# EAGLE schematic SparkFun_Thing_Plus_RA6M5 (EAGLE 9.6.2)

## Sheet 1 of 2
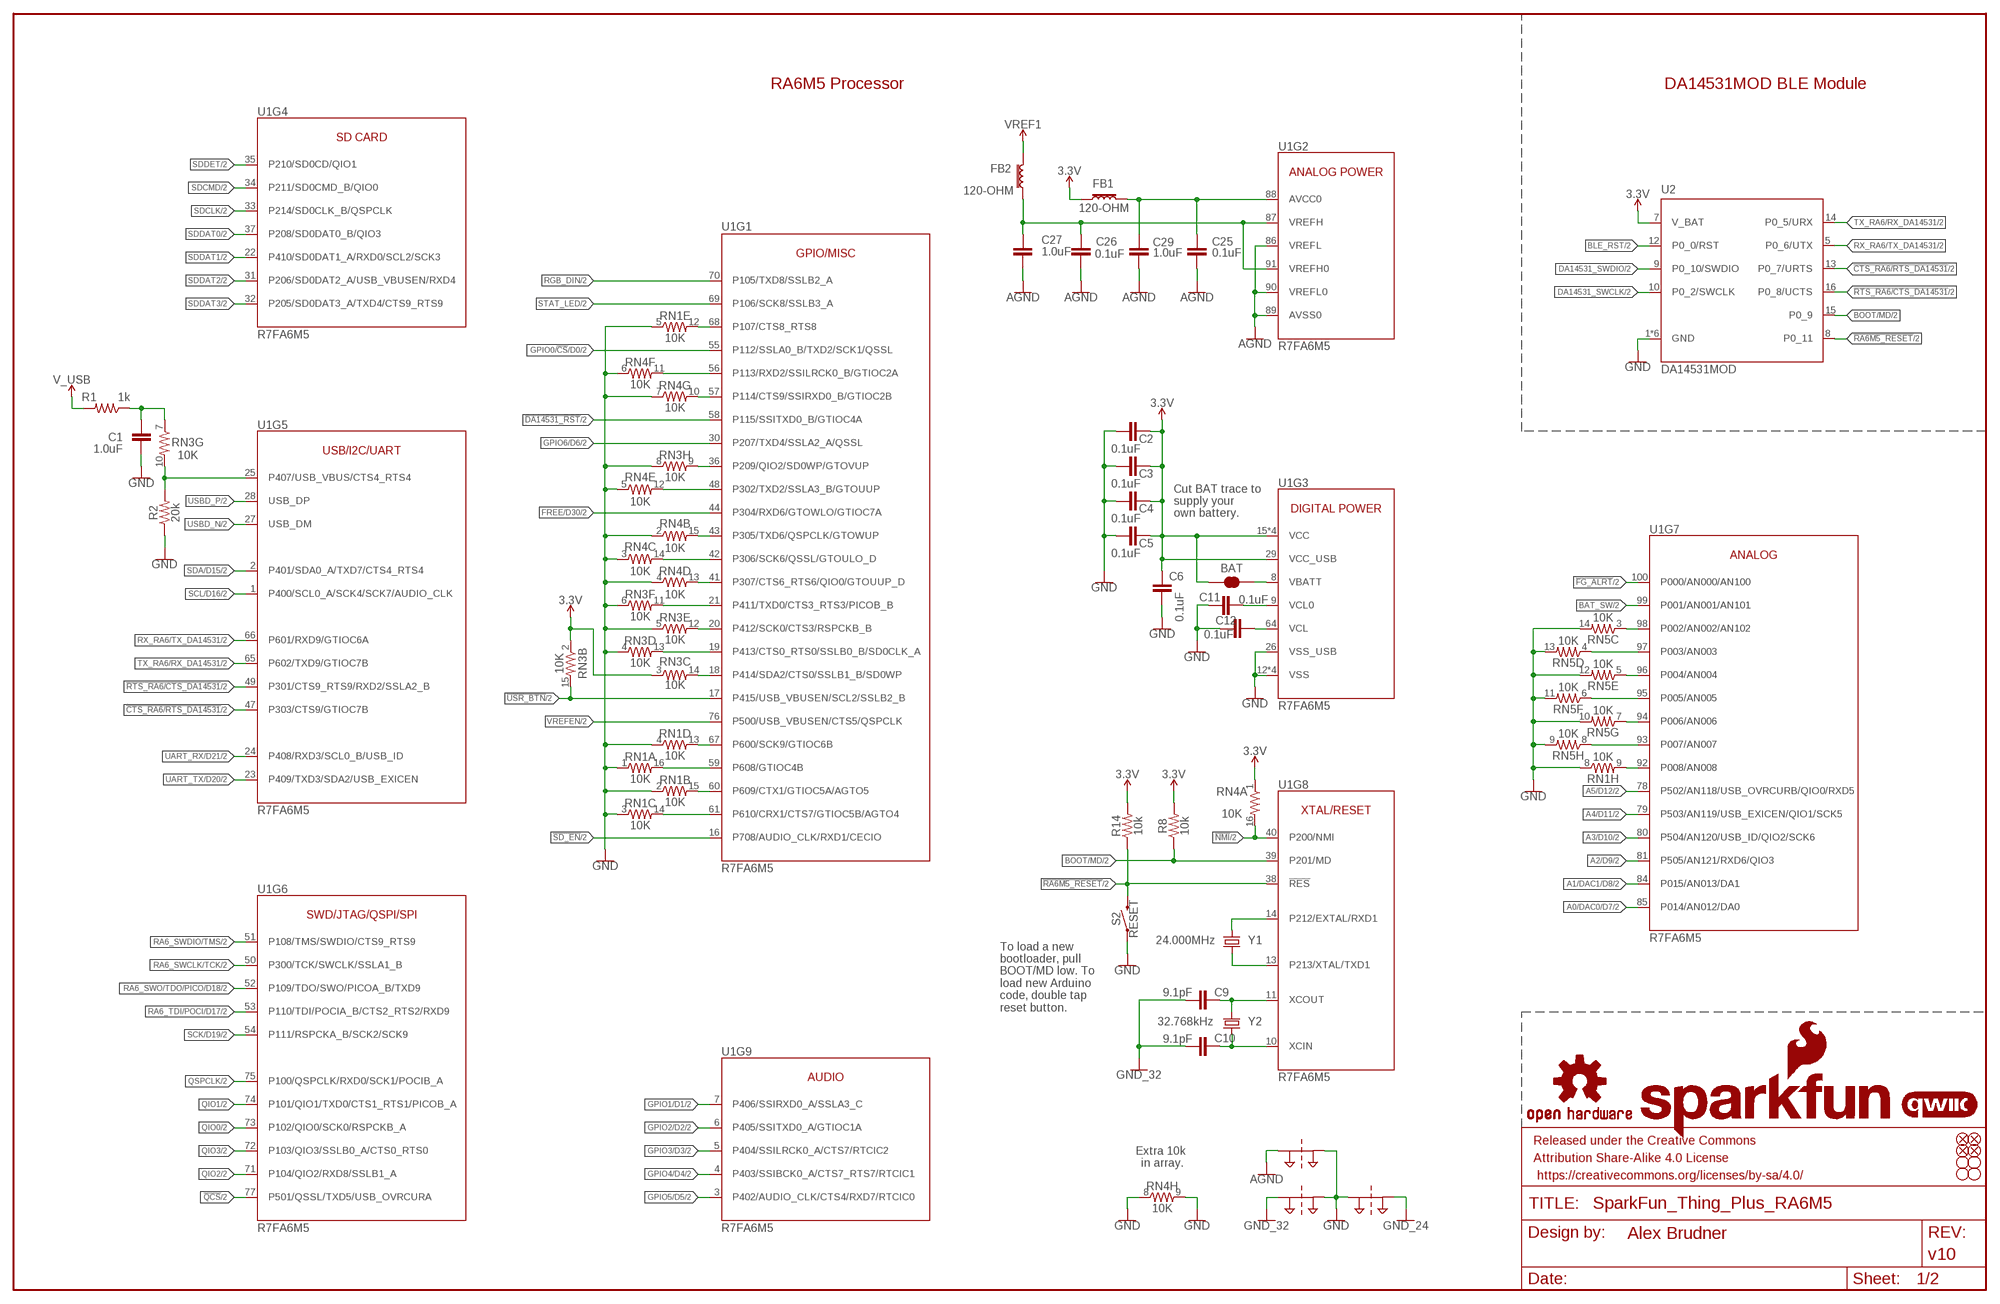
[diagram p0: schematic, sheet 1]

### Parts
BAT  JUMPER-SMT_2_NC_TRACE_SILK  [SMT-JUMPER_2_NC_TRACE_SILK]
C1  1.0uF  1.0UF-0402T-16V-10%  [0402-TIGHT]
C2  0.1uF  0.1UF-0402T-16V-10%  [0402-TIGHT]
C3  0.1uF  0.1UF-0402T-16V-10%  [0402-TIGHT]
C4  0.1uF  0.1UF-0402T-16V-10%  [0402-TIGHT]
C5  0.1uF  0.1UF-0402T-16V-10%  [0402-TIGHT]
C6  0.1uF  0.1UF-0402T-16V-10%  [0402-TIGHT]
C9  9.1pF  9.1PF-0402-TIGHT  [0402-TIGHT]
C10  9.1pF  9.1PF-0402-TIGHT  [0402-TIGHT]
C11  0.1uF  0.1UF-0402T-16V-10%  [0402-TIGHT]
C12  0.1uF  0.1UF-0402T-16V-10%  [0402-TIGHT]
C25  0.1uF  0.1UF-0402T-16V-10%  [0402-TIGHT]
C26  0.1uF  0.1UF-0402T-16V-10%  [0402-TIGHT]
C27  1.0uF  1.0UF-0402T-16V-10%  [0402-TIGHT]
C29  1.0uF  1.0UF-0402T-16V-10%  [0402-TIGHT]
FB1  120-OHM  FERRITE_BEAD-120_OHM-0402T  [0402-TIGHT]
FB2  120-OHM  FERRITE_BEAD-120_OHM-0402T  [0402-TIGHT]
FD1  FIDUCIALUFIDUCIAL  [FIDUCIAL-MICRO]
FD2  FIDUCIALUFIDUCIAL  [FIDUCIAL-MICRO]
FD3  FIDUCIALUFIDUCIAL  [FIDUCIAL-MICRO]
FD4  FIDUCIALUFIDUCIAL  [FIDUCIAL-MICRO]
FRAME1  FRAME-LEDGER  [CREATIVE_COMMONS]
H1  STAND-OFFTIGHT  [STAND-OFF-TIGHT]
H2  STAND-OFFTIGHT  [STAND-OFF-TIGHT]
H3  STAND-OFFTIGHT  [STAND-OFF-TIGHT]
H4  STAND-OFFTIGHT  [STAND-OFF-TIGHT]
LOGO1  OSHW-LOGOMINI  [OSHW-LOGO-MINI]
LOGO2  SFE_LOGO_NAME_FLAME.1_INCH  [SFE_LOGO_NAME_FLAME_.1]
LOGO3  QWIIC_LOGO_4MM  [QWIIC_4MM]
R1  1k  1KOHM-0402T-1/16W-1%  [0402-TIGHT]
R2  20k  20KOHM-0402T-1/16W-1%  [0402-TIGHT]
R8  10k  10KOHM-0402T-1/16W-1%  [0402-TIGHT]
R14  10k  10KOHM-0402T-1/16W-1%  [0402-TIGHT]
RN1  10K  10KOHM-ARRAY(8)-2506_ARV-1/16W-5%  [2506_AR]
RN3  10K  10KOHM-ARRAY(8)-2506_ARV-1/16W-5%  [2506_AR]
RN4  10K  10KOHM-ARRAY(8)-2506_ARV-1/16W-5%  [2506_AR]
RN5  10K  10KOHM-ARRAY(8)-2506_ARV-1/16W-5%  [2506_AR]
S2  RESET  MOMENTARY-SWITCH-SPST-SMD-4.6X2.8MM  [TACTILE_SWITCH_SMD_4.6X2.8MM]
SUPPLYTIE1  2PT_GND_TIESMALL  [2PT_GND_TIE_SMALL]
SUPPLYTIE2  2PT_GND_TIESMALL  [2PT_GND_TIE_SMALL]
SUPPLYTIE3  2PT_GND_TIESMALL  [2PT_GND_TIE_SMALL]
U1  R7FA6M5  R7FA6M5-100LQFP  [P-LQFP100-14X14-0.50]
U2  DA14531MOD  [DA14531MOD]
Y1  24.000MHz  CRYSTAL-24.000MHZ-8PF-4-SMD  [4-SMD,32X25]
Y2  32.768kHz  CRYSTAL-32.768KHZSMD-3.2X1.5  [CRYSTAL-SMD-3.2X1.5MM]

### Nets
3.3V [Power]: BAT.1 C2.1 C3.1 C4.1 C5.1 C6.1 FB1.1 R8.2 R14.2 RN3.2 RN3.3 RN4.1 U1.15(VCC) U1.29(VCC_USB) U1.46(VCC) U1.62(VCC) U1.82(VCC) U2.7(V_BAT) ; also sheet 2
!CTS_RA6/RTS_DA14531! [LS Digital]: U1.47(P303/CTS9/GTIOC7B) U2.13(P0_7/URTS) ; also sheet 2
!DA14531_RST!: U1.58(P115/SSITXD0_B/GTIOC4A) ; also sheet 2
!FG_ALRT!: U1.100(P000/AN000/AN100) ; also sheet 2
!NMI!: RN4.16 U1.40(P200/NMI) ; also sheet 2
!QCS!: U1.77(P501/QSSL/TXD5/USB_OVRCURA) ; also sheet 2
!RA6M5_RESET!: R14.1 S2.3 S2.4 U1.38(!RES!) U2.8(P0_11) ; also sheet 2
!RTS_RA6/CTS_DA14531! [LS Digital]: U1.49(P301/CTS9_RTS9/RXD2/SSLA2_B) U2.16(P0_8/UCTS) ; also sheet 2
!SD_EN!: U1.16(P708/AUDIO_CLK/RXD1/CECIO) ; also sheet 2
!USR_BTN!: RN3.15 U1.17(P415/USB_VBUSEN/SCL2/SSLB2_B) ; also sheet 2
A0/DAC0/D7 [Analog]: U1.85(P014/AN012/DA0) ; also sheet 2
A1/DAC1/D8 [Analog]: U1.84(P015/AN013/DA1) ; also sheet 2
A2/D9 [Analog]: U1.81(P505/AN121/RXD6/QIO3) ; also sheet 2
A3/D10 [Analog]: U1.80(P504/AN120/USB_ID/QIO2/SCK6) ; also sheet 2
A4/D11 [Analog]: U1.79(P503/AN119/USB_EXICEN/QIO1/SCK5) ; also sheet 2
A5/D12 [Analog]: U1.78(P502/AN118/USB_OVRCURB/QIO0/RXD5) ; also sheet 2
AGND [Analog Ground]: C25.2 C26.2 C27.2 C29.2 SUPPLYTIE1.P$1 U1.86(VREFL) U1.89(AVSS0) U1.90(VREFL0)
AVCC0 [Power]: C25.1 C29.1 FB1.2 U1.88(AVCC0) ; also sheet 2
BAT_SW: U1.99(P001/AN001/AN101) ; also sheet 2
BLE_RST: U2.12(P0_0/RST) ; also sheet 2
BOOT/MD: R8.1 U1.39(P201/MD) U2.15(P0_9) ; also sheet 2
DA14531_SWCLK [HS Digital]: U2.10(P0_2/SWCLK) ; also sheet 2
DA14531_SWDIO [HS Digital]: U2.9(P0_10/SWDIO) ; also sheet 2
EXTAL [CLK signals]: U1.14(P212/EXTAL/RXD1) Y1.1
FREE/D30: U1.44(P304/RXD6/GTOWLO/GTIOC7A) ; also sheet 2
GND [Power]: C1.1 C2.2 C3.2 C4.2 C5.2 C6.2 C11.2 C12.2 R2.1 RN1.1 RN1.2 RN1.3 RN1.4 RN1.5 RN1.8 RN3.4 RN3.5 RN3.6 RN3.8 RN4.2 RN4.3 RN4.4 RN4.5 RN4.6 RN4.7 RN4.8 RN4.9 RN5.9 RN5.10 RN5.11 RN5.12 RN5.13 RN5.14 S2.1 S2.2 SUPPLYTIE1.P$2 SUPPLYTIE2.P$2 SUPPLYTIE3.P$1 U1.12(VSS) U1.26(VSS_USB) U1.45(VSS) U1.63(VSS) U1.83(VSS) U2.1(GND) U2.2(GND) U2.3(GND) U2.4(GND) U2.6(GND) U2.11(GND) ; also sheet 2
GND_24 [CLK grounds]: SUPPLYTIE3.P$2
GND_32 [CLK grounds]: C9.1 C10.1 SUPPLYTIE2.P$1
GPIO0/!CS!/D0: U1.55(P112/SSLA0_B/TXD2/SCK1/QSSL) ; also sheet 2
GPIO1/D1: U1.7(P406/SSIRXD0_A/SSLA3_C) ; also sheet 2
GPIO2/D2: U1.6(P405/SSITXD0_A/GTIOC1A) ; also sheet 2
GPIO3/D3: U1.5(P404/SSILRCK0_A/CTS7/RTCIC2) ; also sheet 2
GPIO4/D4: U1.4(P403/SSIBCK0_A/CTS7_RTS7/RTCIC1) ; also sheet 2
GPIO5/D5: U1.3(P402/AUDIO_CLK/CTS4/RXD7/RTCIC0) ; also sheet 2
GPIO6/D6: U1.30(P207/TXD4/SSLA2_A/QSSL) ; also sheet 2
N$7: RN1.9 U1.92(P008/AN008)
N$8: RN3.9 U1.36(P209/QIO2/SD0WP/GTOVUP)
N$9: C1.2 R1.1 RN3.7
N$13: RN3.14 U1.18(P414/SDA2/CTS0/SSLB1_B/SD0WP)
N$15: R2.2 RN3.10 U1.25(P407/USB_VBUS/CTS4_RTS4)
N$17: RN1.14 U1.61(P610/CRX1/CTS7/GTIOC5B/AGTO4)
N$18: RN1.15 U1.60(P609/CTX1/GTIOC5A/AGTO5)
N$22: RN1.16 U1.59(P608/GTIOC4B)
N$23: RN4.15 U1.43(P305/TXD6/QSPCLK/GTOWUP)
N$24: RN1.13 U1.67(P600/SCK9/GTIOC6B)
N$26: RN3.13 U1.19(P413/CTS0_RTS0/SSLB0_B/SD0CLK_A)
N$27: RN3.12 U1.20(P412/SCK0/CTS3/RSPCKB_B)
N$28: RN3.11 U1.21(P411/TXD0/CTS3_RTS3/PICOB_B)
N$29 [Power]: C26.1 C27.1 FB2.1 U1.87(VREFH) U1.91(VREFH0)
N$30: RN4.13 U1.41(P307/CTS6_RTS6/QIO0/GTOUUP_D)
N$31: RN4.12 U1.48(P302/TXD2/SSLA3_B/GTOUUP)
N$32: RN4.14 U1.42(P306/SCK6/QSSL/GTOULO_D)
N$33 [Power]: BAT.2 U1.8(VBATT)
N$35: RN4.10 U1.57(P114/CTS9/SSIRXD0_B/GTIOC2B)
N$36: RN4.11 U1.56(P113/RXD2/SSILRCK0_B/GTIOC2A)
N$37: RN1.12 U1.68(P107/CTS8_RTS8)
N$41: RN5.8 U1.93(P007/AN007)
N$42: RN5.7 U1.94(P006/AN006)
N$43: RN5.6 U1.95(P005/AN005)
N$44: RN5.5 U1.96(P004/AN004)
N$45: RN5.4 U1.97(P003/AN003)
N$46: RN5.3 U1.98(P002/AN002/AN102)
N$97: C11.1 U1.9(VCL0)
N$98: C12.1 U1.64(VCL)
QIO0 [HS Digital]: U1.73(P102/QIO0/SCK0/RSPCKB_A) ; also sheet 2
QIO1 [HS Digital]: U1.74(P101/QIO1/TXD0/CTS1_RTS1/PICOB_A) ; also sheet 2
QIO2 [HS Digital]: U1.71(P104/QIO2/RXD8/SSLB1_A) ; also sheet 2
QIO3 [HS Digital]: U1.72(P103/QIO3/SSLB0_A/CTS0_RTS0) ; also sheet 2
QSPCLK [HS Digital]: U1.75(P100/QSPCLK/RXD0/SCK1/POCIB_A) ; also sheet 2
RA6_SWCLK/TCK [HS Digital]: U1.50(P300/TCK/SWCLK/SSLA1_B) ; also sheet 2
RA6_SWDIO/TMS [HS Digital]: U1.51(P108/TMS/SWDIO/CTS9_RTS9) ; also sheet 2
RA6_SWO/TDO/PICO/D18 [HS Digital]: U1.52(P109/TDO/SWO/PICOA_B/TXD9) ; also sheet 2
RA6_TDI/POCI/D17 [HS Digital]: U1.53(P110/TDI/POCIA_B/CTS2_RTS2/RXD9) ; also sheet 2
RGB_DIN [LS Digital]: U1.70(P105/TXD8/SSLB2_A) ; also sheet 2
RX_RA6/TX_DA14531 [LS Digital]: U1.66(P601/RXD9/GTIOC6A) U2.5(P0_6/UTX) ; also sheet 2
SCK/D19 [HS Digital]: U1.54(P111/RSPCKA_B/SCK2/SCK9) ; also sheet 2
SCL/D16 [LS Digital]: U1.1(P400/SCL0_A/SCK4/SCK7/AUDIO_CLK) ; also sheet 2
SDA/D15 [LS Digital]: U1.2(P401/SDA0_A/TXD7/CTS4_RTS4) ; also sheet 2
SDCLK [HS Digital]: U1.33(P214/SD0CLK_B/QSPCLK) ; also sheet 2
SDCMD [LS Digital]: U1.34(P211/SD0CMD_B/QIO0) ; also sheet 2
SDDAT0 [HS Digital]: U1.37(P208/SD0DAT0_B/QIO3) ; also sheet 2
SDDAT1 [HS Digital]: U1.22(P410/SD0DAT1_A/RXD0/SCL2/SCK3) ; also sheet 2
SDDAT2 [HS Digital]: U1.31(P206/SD0DAT2_A/USB_VBUSEN/RXD4) ; also sheet 2
SDDAT3 [HS Digital]: U1.32(P205/SD0DAT3_A/TXD4/CTS9_RTS9) ; also sheet 2
SDDET: U1.35(P210/SD0CD/QIO1) ; also sheet 2
STAT_LED: U1.69(P106/SCK8/SSLB3_A) ; also sheet 2
TX_RA6/RX_DA14531 [LS Digital]: U1.65(P602/TXD9/GTIOC7B) U2.14(P0_5/URX) ; also sheet 2
UART_RX/D21 [LS Digital]: U1.24(P408/RXD3/SCL0_B/USB_ID) ; also sheet 2
UART_TX/D20 [LS Digital]: U1.23(P409/TXD3/SDA2/USB_EXICEN) ; also sheet 2
USBD_N [USB diff]: U1.27(USB_DM) ; also sheet 2
USBD_P [USB diff]: U1.28(USB_DP) ; also sheet 2
V_USB [Power]: R1.2 ; also sheet 2
VREF1 [Power]: FB2.2 ; also sheet 2
VREFEN: U1.76(P500/USB_VBUSEN/CTS5/QSPCLK) ; also sheet 2
XCIN [CLK signals]: C10.2 U1.10(XCIN) Y2.P$1
XCOUT [CLK signals]: C9.2 U1.11(XCOUT) Y2.P$2
XTAL [CLK signals]: U1.13(P213/XTAL/TXD1) Y1.3

### Notes on the sheet
- RA6M5 Processor | DA14531MOD BLE Module
- Cut BAT trace to 
  supply your 
  own battery.
- To load a new 
  bootloader, pull 
  BOOT/MD low. To 
  load new Arduino 
  code, double tap 
  reset button.
- Extra 10k 
  in array.

## Sheet 2 of 2
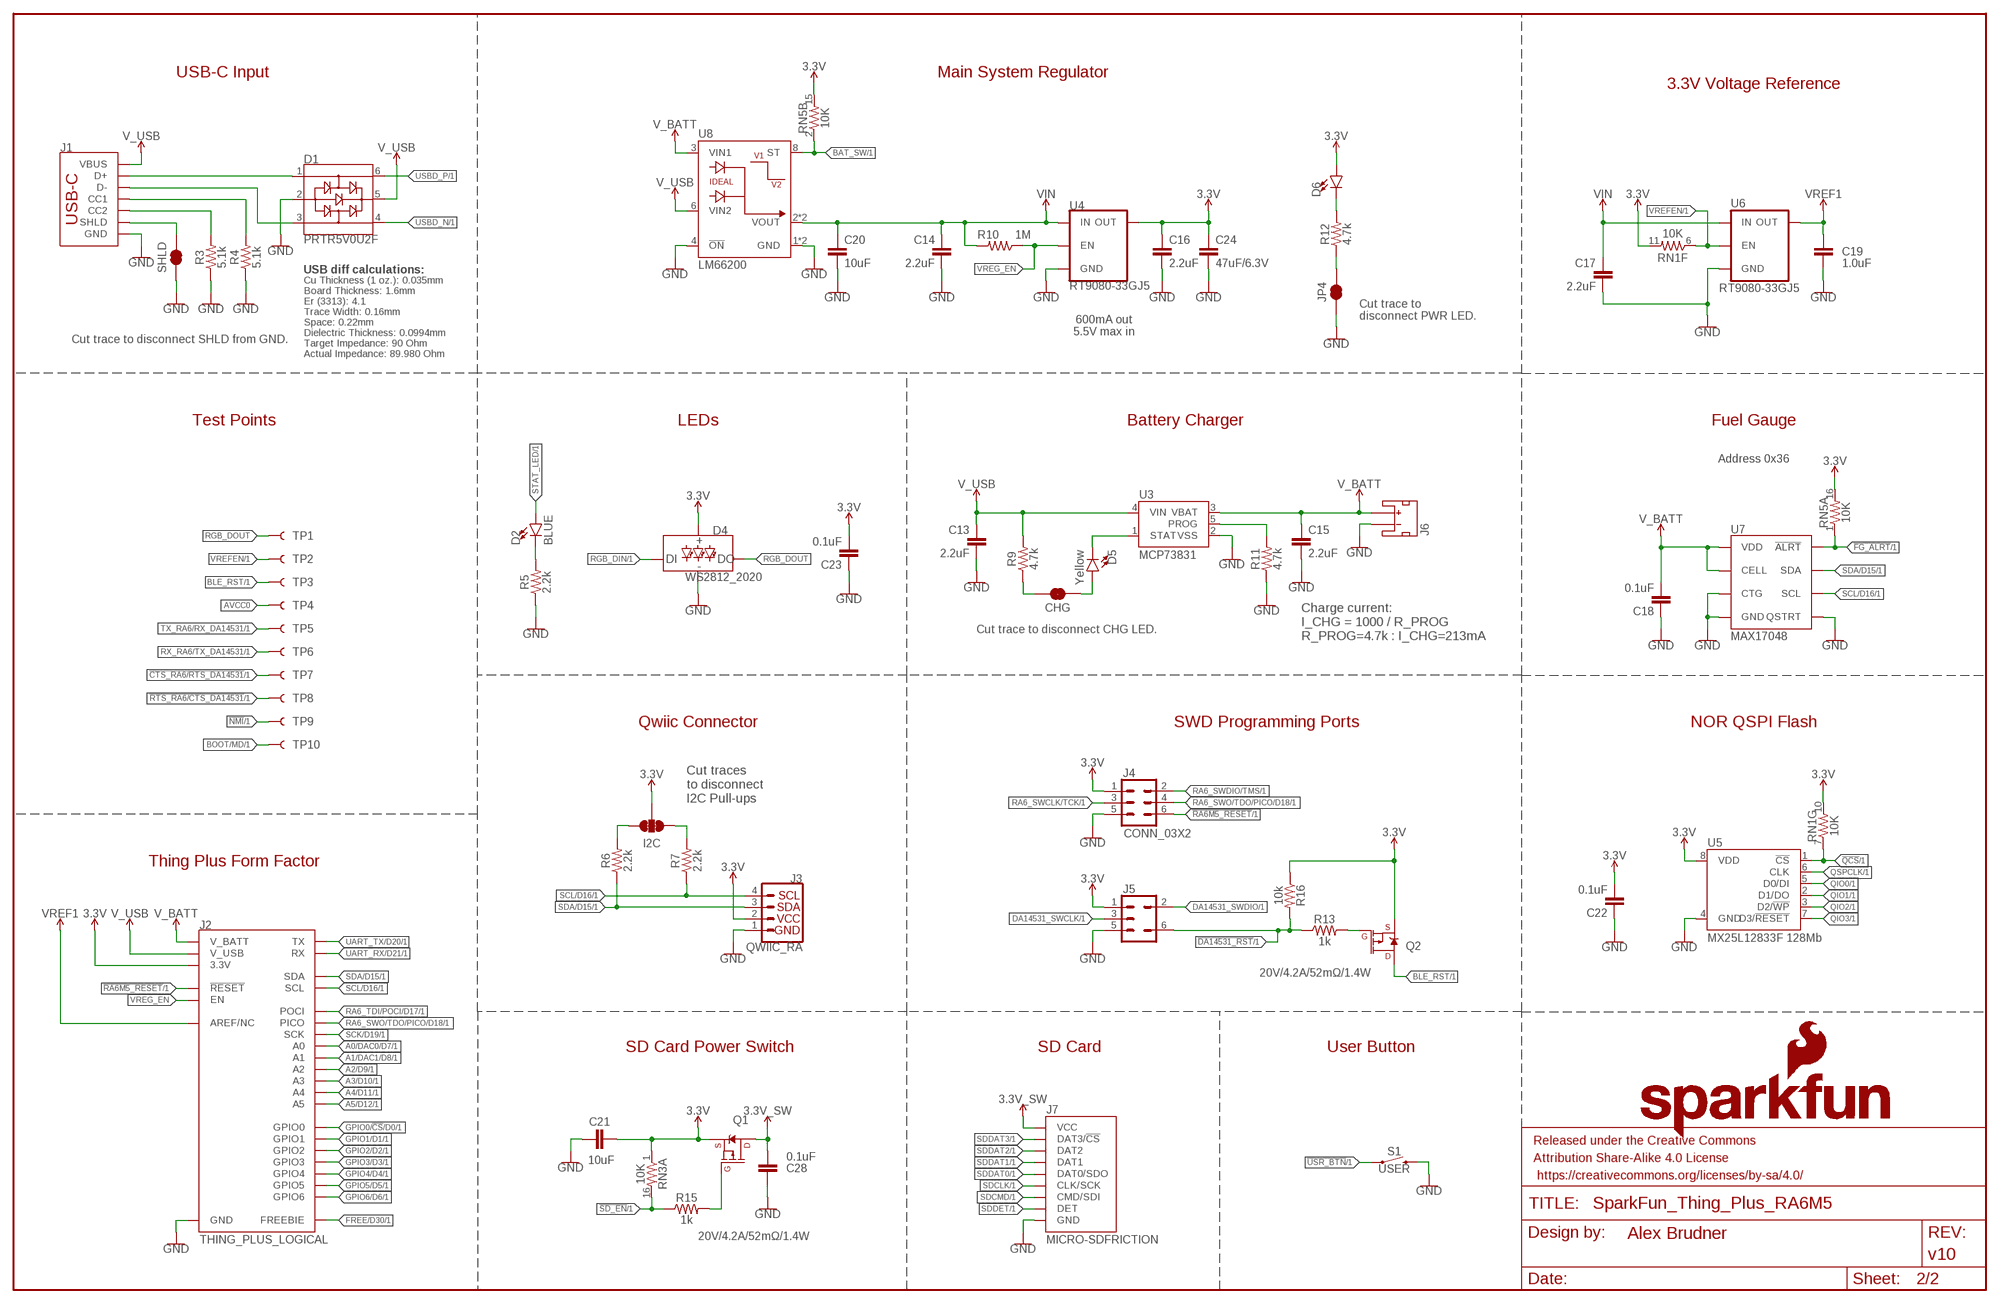
[diagram p1: schematic, sheet 2]

### Parts
C13  2.2uF  2.2UF-0402_TIGHT-10V-10%-X5R  [0402-TIGHT]
C14  2.2uF  2.2UF-0402_TIGHT-10V-10%-X5R  [0402-TIGHT]
C15  2.2uF  2.2UF-0402_TIGHT-10V-10%-X5R  [0402-TIGHT]
C16  2.2uF  2.2UF-0402_TIGHT-10V-10%-X5R  [0402-TIGHT]
C17  2.2uF  2.2UF-0402_TIGHT-10V-10%-X5R  [0402-TIGHT]
C18  0.1uF  0.1UF-0402T-16V-10%  [0402-TIGHT]
C19  1.0uF  1.0UF-0402T-16V-10%  [0402-TIGHT]
C20  10uF  10UF-0805-25V-10%  [0805]
C21  10uF  10UF-0805-25V-10%  [0805]
C22  0.1uF  0.1UF-0402T-16V-10%  [0402-TIGHT]
C23  0.1uF  0.1UF-0402T-16V-10%  [0402-TIGHT]
C24  47uF/6.3V  47UF  [0805]
C28  0.1uF  0.1UF-0402T-16V-10%  [0402-TIGHT]
CHG  JUMPER-SMT_2_NC_TRACE_SILK  [SMT-JUMPER_2_NC_TRACE_SILK]
D1  PRTR5V0U2F  [SOT886]
D2  BLUE  LED-BLUE0603  [LED-0603]
D4  WS2812_2020  [WS2812-2020]
D5  Yellow  LED-YELLOW0603  [LED-0603]
D6  LED-RED_0603-KB  [LED-0603]
FRAME2  FRAME-LEDGERNO_FOOTPRINT  [DUMMY]
I2C  JUMPER-SMT_3_2-NC_TRACE_SILK  [SMT-JUMPER_3_2-NC_TRACE_SILK]
J1  USB Female Type C Connector  USB_C_6-LAYER-ISOLATED  [USB-C-16P-6LAYER-ISOLATED]
J2  THING_PLUS_LOGICAL  [THING_PLUS]
J3  QWIIC_RA  QWIIC_CONNECTORJS-1MM  [JST04_1MM_RA]
J4  CONN_03X2  [PAD_05_03X2_TP]
J5  SWD-5PIN  [PAD_05_03X2_TP_NO4]
J6  JST_2MM_MALE  [JST-2-SMD]
J7  MICRO-SDFRICTION  [MICROSD_TINY]
JP4  JUMPER-SMT_2_NC_TRACE_SILK  [SMT-JUMPER_2_NC_TRACE_SILK]
LOGO4  SFE_LOGO_NAME_FLAMEBLANK  [BLANK]
Q1  20V/4.2A/52mΩ/1.4W  MOSFET_PCH-DMG2305UX-7  [SOT23-3]
Q2  20V/4.2A/52mΩ/1.4W  MOSFET_PCH-DMG2305UX-7  [SOT23-3]
R3  5.1k  5.1KOHM-0402T-1/16W-1%  [0402-TIGHT]
R4  5.1k  5.1KOHM-0402T-1/16W-1%  [0402-TIGHT]
R5  2.2k  2.2KOHM-0402T-1/16W-1%  [0402-TIGHT]
R6  2.2k  2.2KOHM-0402T-1/16W-1%  [0402-TIGHT]
R7  2.2k  2.2KOHM-0402T-1/16W-1%  [0402-TIGHT]
R9  4.7k  4.7KOHM-0402T-1/16W-1%  [0402-TIGHT]
R10  1M  1MOHM-0402T-1/16W-5%  [0402-TIGHT]
R11  4.7k  4.7KOHM-0402T-1/16W-1%  [0402-TIGHT]
R12  4.7k  4.7KOHM-0402T-1/16W-1%  [0402-TIGHT]
R13  1k  1KOHM-0402T-1/16W-1%  [0402-TIGHT]
R15  1k  1KOHM-0402T-1/16W-1%  [0402-TIGHT]
R16  10k  10KOHM-0402T-1/16W-1%  [0402-TIGHT]
S1  USER  MOMENTARY-SWITCH-SPST-SMD-4.6X2.8MM  [TACTILE_SWITCH_SMD_4.6X2.8MM]
SHLD  JUMPER-SMT_2_NC_TRACE_SILK  [SMT-JUMPER_2_NC_TRACE_SILK]
TP1  TEST-POINT3X5  [PAD.03X.05]
TP2  TEST-POINT3X4  [PAD.03X.04]
TP3  TEST-POINT3X5  [PAD.03X.05]
TP4  TEST-POINT3  [PAD.03X.03]
TP5  TEST-POINT3X5  [PAD.03X.05]
TP6  TEST-POINT3X5  [PAD.03X.05]
TP7  TEST-POINT3X5  [PAD.03X.05]
TP8  TEST-POINT3X5  [PAD.03X.05]
TP9  TEST-POINT3  [PAD.03X.03]
TP10  TEST-POINT3X5  [PAD.03X.05]
U3  MCP73831  [SOT23-5]
U4  RT9080-33GJ5  V_REG_RT9080  [SOT23-5]
U5  MX25L12833F 128Mb  MX25L12833F_128MBIT_QSPI  [WSON-8-6X5]
U6  RT9080-33GJ5  V_REG_RT9080  [SOT23-5]
U7  MAX17048  MAX17048DFN8  [DFN-8]
U8  LM66200  IDEAL_DIODE_DUAL_LM66200  [SOT8]

### Nets
3.3V [Power]: C16.1 C21.1 C22.2 C23.2 C24.1 D4.VCC D6.A I2C.2 J2.27(3.3V) J3.2 J4.1 J5.1 Q1.2(S) Q2.2(S) R16.1 RN1.10 RN1.11 RN3.1 RN5.15 RN5.16 U4.5(OUT) U5.8(VDD) ; also sheet 1
3.3V_SW [Power]: C28.2 J7.4(VCC) Q1.3(D)
!CTS_RA6/RTS_DA14531! [LS Digital]: TP7.1 ; also sheet 1
!DA14531_RST!: J5.6 R13.1 R16.2 ; also sheet 1
!FG_ALRT!: RN5.1 U7.5(!ALRT) ; also sheet 1
!NMI!: TP9.1 ; also sheet 1
!QCS!: RN1.7 U5.1(!CS!) ; also sheet 1
!RA6M5_RESET!: J2.28(!RESET) J4.6 ; also sheet 1
!RTS_RA6/CTS_DA14531! [LS Digital]: TP8.1 ; also sheet 1
!SD_EN!: R15.1 RN3.16 ; also sheet 1
!USR_BTN!: S1.1 S1.2 ; also sheet 1
A0/DAC0/D7 [Analog]: J2.24(A0) ; also sheet 1
A1/DAC1/D8 [Analog]: J2.23(A1) ; also sheet 1
A2/D9 [Analog]: J2.22(A2) ; also sheet 1
A3/D10 [Analog]: J2.21(A3) ; also sheet 1
A4/D11 [Analog]: J2.20(A4) ; also sheet 1
A5/D12 [Analog]: J2.19(A5) ; also sheet 1
AVCC0 [Power]: TP4.1 ; also sheet 1
BAT_SW: RN5.2 U8.8(ST) ; also sheet 1
BLE_RST: Q2.3(D) TP3.1 ; also sheet 1
BOOT/MD: TP10.1 ; also sheet 1
DA14531_SWCLK [HS Digital]: J5.3 ; also sheet 1
DA14531_SWDIO [HS Digital]: J5.2 ; also sheet 1
FREE/D30: J2.13(FREEBIE) ; also sheet 1
GND [Power]: C13.2 C14.2 C15.2 C16.2 C17.2 C18.1 C19.2 C20.2 C21.2 C22.1 C23.1 C24.2 C28.1 D1.2 D4.GND J1.GND J1.GND2(GND) J2.25(GND) J3.1 J4.5 J5.5 J6.1(-) J7.6(GND) J7.GND1(GND) J7.GND2(GND) J7.GND3(GND) J7.GND4(GND) J7.GND5(GND) J7.GND6(GND) JP4.1 R3.1 R4.1 R5.1 R11.1 S1.3 S1.4 SHLD.1 U3.2(VSS) U4.2(GND) U5.4(GND) U6.2(GND) U7.1(CTG) U7.4(GND) U7.6(QSTRT) U7.9(GND) U8.1(GND) U8.4(!ON!) U8.5(GND) ; also sheet 1
GPIO0/!CS!/D0: J2.9(GPIO0) ; also sheet 1
GPIO1/D1: J2.8(GPIO1) ; also sheet 1
GPIO2/D2: J2.7(GPIO2) ; also sheet 1
GPIO3/D3: J2.6(GPIO3) ; also sheet 1
GPIO4/D4: J2.5(GPIO4) ; also sheet 1
GPIO5/D5: J2.4(GPIO5) ; also sheet 1
GPIO6/D6: J2.3(GPIO6) ; also sheet 1
N$1: CHG.2 R9.1
N$2: CHG.1 D5.A
N$3: D5.C U3.1(STAT)
N$4: Q2.1(G) R13.2
N$5: R11.2 U3.5(PROG)
N$6: D2.C R5.2
N$10: I2C.1 R6.2
N$11: I2C.3 R7.2
N$14: JP4.2 R12.1
N$16: D6.C R12.2
N$19: J1.SHLD1(SHLD) J1.SHLD2(SHLD) J1.SHLD3(SHLD) J1.SHLD4(SHLD) J1.SHLD5(SHLD) J1.SHLD6(SHLD) J1.SHLD7(SHLD) J1.SHLD8(SHLD) SHLD.2
N$20: J1.B5(CC2) R3.2
N$21: J1.A5(CC1) R4.2
N$47: Q1.1(G) R15.2
QIO0 [HS Digital]: U5.5(D0/DI) ; also sheet 1
QIO1 [HS Digital]: U5.2(D1/DO) ; also sheet 1
QIO2 [HS Digital]: U5.3(D2/!WP!) ; also sheet 1
QIO3 [HS Digital]: U5.7(D3/!RESET!) ; also sheet 1
QSPCLK [HS Digital]: U5.6(CLK) ; also sheet 1
RA6_SWCLK/TCK [HS Digital]: J4.3 ; also sheet 1
RA6_SWDIO/TMS [HS Digital]: J4.2 ; also sheet 1
RA6_SWO/TDO/PICO/D18 [HS Digital]: J2.17(PICO) J4.4 ; also sheet 1
RA6_TDI/POCI/D17 [HS Digital]: J2.16(POCI) ; also sheet 1
RGB_DIN [LS Digital]: D4.DI ; also sheet 1
RGB_DOUT [LS Digital]: D4.DO TP1.1
RX_RA6/TX_DA14531 [LS Digital]: TP6.1 ; also sheet 1
SCK/D19 [HS Digital]: J2.18(SCK) ; also sheet 1
SCL/D16 [LS Digital]: J2.2(SCL) J3.4 R7.1 U7.7(SCL) ; also sheet 1
SDA/D15 [LS Digital]: J2.1(SDA) J3.3 R6.1 U7.8(SDA) ; also sheet 1
SDCLK [HS Digital]: J7.5(CLK/SCK) ; also sheet 1
SDCMD [LS Digital]: J7.3(CMD/SDI) ; also sheet 1
SDDAT0 [HS Digital]: J7.7(DAT0/SDO) ; also sheet 1
SDDAT1 [HS Digital]: J7.8(DAT1) ; also sheet 1
SDDAT2 [HS Digital]: J7.1(DAT2) ; also sheet 1
SDDAT3 [HS Digital]: J7.2(DAT3/!CS!) ; also sheet 1
SDDET: J7.9(DET) ; also sheet 1
STAT_LED: D2.A ; also sheet 1
TX_RA6/RX_DA14531 [LS Digital]: TP5.1 ; also sheet 1
UART_RX/D21 [LS Digital]: J2.15(RX) ; also sheet 1
UART_TX/D20 [LS Digital]: J2.14(TX) ; also sheet 1
USBD_N [USB diff]: D1.4 ; also sheet 1
USBD_P [USB diff]: D1.6 ; also sheet 1
USBIN_N [USB diff]: D1.3 J1.A7(D-) J1.B7(D-)
USBIN_P [USB diff]: D1.1 J1.A6(D+) J1.B6(D+)
V_BATT [Power]: C15.1 C18.2 J2.12(V_BATT) J6.2(+) U3.3(VBAT) U7.2(CELL) U7.3(VDD) U8.3(VIN1)
V_USB [Power]: C13.1 D1.5 J1.VBUS1(VBUS) J1.VBUS2(VBUS) J2.10(V_USB) R9.2 U3.4(VIN) U8.6(VIN2) ; also sheet 1
VIN [Power]: C14.1 C17.1 C20.1 R10.2 U4.1(IN) U6.1(IN) U8.2(VOUT) U8.7(VOUT)
VREF1 [Power]: C19.1 J2.26(AREF/NC) U6.5(OUT) ; also sheet 1
VREFEN: RN1.6 TP2.1 U6.3(EN) ; also sheet 1
VREG_EN: J2.11(EN) R10.1 U4.3(EN)
Unconnected: J6.NC1(PAD1) J6.NC2(PAD2)

### Notes on the sheet
- USB-C Input | Main System Regulator
- 3.3V Voltage Reference
- USB diff calculations:
- Cu Thickness (1 oz.): 0.035mm
  Board Thickness: 1.6mm
  Er (3313): 4.1
  Trace Width: 0.16mm
  Space: 0.22mm
  Dielectric Thickness: 0.0994mm
  Target Impedance: 90 Ohm
  Actual Impedance: 89.980 Ohm
- 600mA out
  5.5V max in
- Cut trace to 
  disconnect PWR LED.
- Cut trace to disconnect SHLD from GND.
- Test Points | LEDs | Battery Charger | Fuel Gauge
- Address 0x36
- Cut trace to disconnect CHG LED.
- Charge current:
  I_CHG = 1000 / R_PROG
  R_PROG=4.7k : I_CHG=213mA
- Qwiic Connector | SWD Programming Ports | NOR QSPI Flash
- Cut traces 
  to disconnect 
  I2C Pull-ups
- Thing Plus Form Factor
- SD Card Power Switch | SD Card | User Button

## Library data of the parts
BAT CHG JP4 SHLD = SparkFun-Jumpers:JUMPER-SMT_2_NC_TRACE: Normally closed trace jumper This jumper has a trace between two pads so it's normally closed (NC). Use a razor knife to open the connection. For best results follow the IPC guidelines for cutting traces: Cutout at least 0.063 mm (0.005 in). Remove all loose material to clean up the cut area. Seal the cut with an approved epoxy. Reapply solder to reclose the connection.
C1 C19 C27 C29 = SparkFun-Capacitors:1.0UF: 1µF ceramic capacitors A capacitor is a passive two-terminal electrical component used to store electrical energy temporarily in an electric field.; PROD_ID: CAP-12417
C2-C6 C11 C12 C18 C22 C23 C25 C26 C28 = SparkFun-Capacitors:0.1UF: 0.1µF ceramic capacitors A capacitor is a passive two-terminal electrical component used to store electrical energy temporarily in an electric field.; PROD_ID: CAP-12416
C9 C10 = SparkFun-Capacitors:9.1PF: 9.1pF ceramic capacitors A capacitor is a passive two-terminal electrical component used to store electrical energy temporarily in an electric field.; MOUSER_PART: 609-500R07S9R1CV4T; PROD_ID: CAP-15278
C13-C17 = SparkFun-Capacitors:2.2UF: 2.2µF ceramic capacitors A capacitor is a passive two-terminal electrical component used to store electrical energy temporarily in an electric field.; PROD_ID: CAP-14232
C20 C21 = SparkFun-Capacitors:10UF: 10.0µF ceramic capacitors A capacitor is a passive two-terminal electrical component used to store electrical energy temporarily in an electric field.; PROD_ID: CAP-14259
C24 = SparkFun-Capacitors:47UF; PROD_ID: CAP-13854
D1 = SparkFun-IC-Power:PRTR5V0U2: A small ESD protection device. Most commonly used on USB D+/D- signals to protect large, expensive, or especially sensitive USB enabled devices.; PROD_ID: DIO-14084
D2 = SparkFun-LED:LED-BLUE: Blue SMD LED Used in manufacturing of various products at SparkFun Packages: 0603 - SMD 0603 package [Product Link] <http://www.digikey.com/product-detail/en/SMLE12BC7TT86/511-1589-2-ND/1641808> 1206 - SMD1206 package [Product Link] <http://www.digikey.com/product-detail/en/lite-on-inc/LTST-C150TBKT/160-1643-1-ND/573584> SparkFun Products: ESP8266 Thing-Dev Board <https://www.sparkfun.com/products/13711> RedBoard <https://www.sparkfun.com/products/12757>; PROD_ID: DIO-08575
D4 = SparkFun-LED:WS2812: Addressable RGB LED - 1 Wire Common names: WS2812, SK6812, Neopixel, APA-106, etc. SMD LED with built-in controller IC. Color: Red/Green/Blue SparkFun Products: LED-SMD RGB (WS2812) <https://www.sparkfun.com/products/11821> LED - RGB Addressable, PTH, 5mm Diffused (5 Pack) <https://www.sparkfun.com/products/12986> LED - RGB Addressable, PTH, 5mm Clear (5 Pack) <https://www.sparkfun.com/products/12999> Blynk Board - ESP8266 <https://www.sparkfun.com/products/13794> Datasheet referenced for footprint: WS2812B-PTH <https://cdn.sparkfun.com/datasheets/Components/LED/COM-12877.pdf>; PROD_ID: DIO-15591
D5 = SparkFun-LED:LED-YELLOW: Yellow SMD LED Used in manufacturing several products at SparkFun. Packages: 0603 - SMD 0603 package[Product Link] <http://www.kingbrightusa.com/product.asp?catalog_name=LED&product_id=APT1608SYCK> 0603 -SMART - SMART SMD 0603 package (more efficient/more expensive) [Product Link] <http://www.osram-os.com/osram_os/en/products/product-catalog/led-light-emitting-diodes/smartled-0603/ly-l29k/index.jsp> LilyPad - SMD1206 package[Product Datasheet] <https://www.sparkfun.com/datasheets/DevTools/LilyPad/Q150YUS4.pdf> SparkFun Products: Blynk Board <https://www.sparkfun.com/products/13794> IOIO-OTG <https://www.sparkfun.com/products/13613> XBee Explorer Serial <https://www.sparkfun.com/products/13225>; PROD_ID: DIO-09003
D6 = SparkFun-LED:LED-RED: Red SMD LED Used in manufacturing of most products at SparkFun Packages: 0603 - KB - KingBright (DIO-17976) SMD 0603 package [Datasheet] <https://www.kingbrightusa.com/images/catalog/SPEC/APT1608SURCK.pdf> 0603 - (DIO-00819, has gone EOL) SMD 0603 package 0603 SMART - SMD 0603 SMART package ( more efficient and expensive)[Product Link] <http://www.osram-os.com/Graphics/XPic2/00077099_0.pdf> 1206 - SMD1206 package [Product Link] <https://www.sparkfun.com/datasheets/DevTools/LilyPad/Q150OVS4.pdff> SparkFun Products: Pro Mini 328 -5V <https://www.sparkfun.com/products/821> RedBoard <https://www.sparkfun.com/products/12757> IOIO-OTG <https://www.sparkfun.com/products/13613>; PROD_ID: DIO-17976
FB1 FB2 = SparkFun-Coils:FERRITE_BEAD-120_OHM: Ferrite Bead (blocks, cores, rings, chokes, etc.) Inductor with layers of ferrite used to suppress high frequencies. Often used to isolate high frequency noise.; PROD_ID: NDUC-14206
FD1-FD4 = SparkFun-Aesthetics:FIDUCIAL: Fiducial Alignment Points Point-of-reference for pick-and-place machines and other optical instruments.
FRAME1 FRAME2 = SparkFun-Aesthetics:FRAME-LEDGER: Schematic Frame - Ledger Standard 11x14 US Ledger frame; DESIGNER: Alex Brudner; REV: v10
H1-H4 = SparkFun-Hardware:STAND-OFF: Stand Off Drill holes for mechanically mounting via screws, standoffs, etc. Note: Use the keepout ring to avoid running the screw head into surrounding components. Variant Overviews STAND-OFF - Mechanical footprint for a #4 phillips button head screw. STAND-OFF-TIGHT - Mechanical footprint for a #4 phillips button head screw, Example SparkFun Products Screw - Phillips Head (1/4", 4-40, 10 pack) <https://www.sparkfun.com/products/10453> (PRT-10453) Screw - Phillips Head (1/2", 4-40, 10 pack) <https://www.sparkfun.com/products/10452> (PRT-10452) Screw - Phillips Head (3/4", 4-40, 10 pack) <https://www.sparkfun.com/products/10451> (PRT-10451) Screw - Phillips Head (1", 4-40, 10 pack) <https://www.sparkfun.com/products/10450> (PRT-10450)
I2C = SparkFun-Jumpers:JUMPER-SMT_3_2-NC_TRACE: Normally closed trace jumper (2 of 2 connections) This jumper has a trace between all three pads so they are normally closed (NC). Use a razor knife to open the connection(s). For best results follow the IPC guidelines for cutting traces: Cutout at least 0.063 mm (0.005 in). Remove all loose material to clean up the cut area. Seal the cut with an approved epoxy. Reapply solder to reclose the connection(s).
J1 = SparkFun_Thing_Plus_RA6M5:USB_C: USB Type C 16Pin Connector Super Speed pins not available on the 16-pin purely SMD connector so this part is best for USB 2.0 implementations. D1 and D2 are tied together enabling D+/- no matter which way the cable is plugged into the connector. The two channel configuration pins (CC1/2) are exposed. These are normally connected to ground via 5.1k resistors but can be reconfigured for high current/high power applications. **4-LAYER BOARD WARNING!!** If designing 4-layer board, make sure to select the variant _4-LAYER-ISOLATED. The linked footprint (USB-C-16-4LAYER-ISOLATED) includes some very necessary cutout polygons in the inner layers (2 and 15). This prevents the PTH mounting shield legs on the USB connector from electrically connecting any other polygons on the inner layers (usually VCC and GND).; PROD_ID: CONN-14122
J2 = SparkFun-Boards:THING_PLUS_LOGICAL
J3 = SparkFun-Connectors:QWIIC_CONNECTOR: SparkFun I2C Standard Qwiic Connector An SMD 1mm pitch JST connector makes it easy and quick (get it? Qwiic?) to connect I2C devices to each other. The Qwiic system <http://www.sparkfun.com/qwiic> enables fast and solderless connection between popular platforms and various sensors and actuators. We carry 200mm <https://www.sparkfun.com/products/14204>, 100mm <https://www.sparkfun.com/products/14205>, 50mm <https://www.sparkfun.com/products/14206>, and breadboard friendly <https://www.sparkfun.com/products/14207> Qwiic cables. We also offer 10 pcs strips <https://www.sparkfun.com/products/14323> the SMD connectors.; PROD_ID: CONN-13694; VALUE: QWIIC_RIGHT_ANGLE
J4 = SparkFun_Thing_Plus_RA6M5:CONN_03X2
J5 = SparkFun-Connectors:SWD-5PIN: 5-pin SWD connector Test-point based header for SWD. Pin 1 - PWR Pin 2 - SWDIO Pin 3 - SWCLK Pin 4 - NC Pin 5 - GND Pin 6 - RESET
J6 = SparkFun-Connectors:JST_2MM_MALE: JST 2MM MALE RA CONNECTOR Two pin, compact surface mount connector. Commonly used as a battery input connection point. We really like the solid locking feeling and high current rating on these small connectors. We use these all the time as battery connectors. Mates to single-cell LiPo batteries. Here is the connector we sell at SparkFun: JST Right Angle Connector - White <https://www.sparkfun.com/products/8612> (PRT-08612) Datasheet <http://www.sparkfun.com/datasheets/Prototyping/Connectors/JST-Horizontal.pdf> It was used on these SparkFun products: SparkFun MOSFET Power Controller <https://www.sparkfun.com/products/11214> (PRT-11214) SparkFun Battery Babysitter - LiPo Battery Manager <https://www.sparkfun.com/products/13777> (PRT-13777) And many, many others that required a lipo battery connection.; PROD_ID: CONN-11443; SF_ID: PRT-08612
J7 = SparkFun-Connectors:MICRO-SD: microSD Socket for Transflash Various sockets for µSD. tDoc lines correctly indicate media card edge positions when inserting (unlocked, locked, depressed). NOTE: CD1 and CD2 are connected internally, and the default detect state of the socket is detect pin to ground. SparkFun Products: WAV Trigger <https://www.sparkfun.com/products/13660> CAN-Bus Shield <https://www.sparkfun.com/products/13262> SparkFun Level Shifing microSD Breakout <https://www.sparkfun.com/products/13743>; PROD_ID: CONN-13500
LOGO1 = SparkFun-Aesthetics:OSHW-LOGO: Open-Source Hardware (OSHW) Logo This logo indicates the piece of hardware it is found on incorporates a OSHW license and/or adheres to the definition of open source hardware found here: http://freedomdefined.org/OSHW
LOGO2 LOGO4 = SparkFun-Aesthetics:SFE_LOGO_NAME_FLAME: SparkFun Font Logo w/ Flame This is the SparkFun full logo. The logo on the schematic will always be the same size; the package variant is the height of the flame part of the logo. Default layer for the logo on the board is tSilk.
LOGO3 = SparkFun-Aesthetics:QWIIC_LOGO: Qwiic Logos for placement on schematic and PCB. The 5.5mm silk logo is best for placing next to Qwiic connector.
Q1 Q2 = SparkFun-DiscreteSemi:MOSFET_PCH: P-channel MOSFETs Voltage controlled devices that allow control of high current outputs. SparkFun Products: SparkFun ESP32 Thing <https://www.sparkfun.com/products/13907> SparkFun ESP8266 Thing <https://www.sparkfun.com/products/13231> SparkFun Pi Servo HAT V2 <https://www.sparkfun.com/products/15316> DMG2305UX-7 (20V/4.2A/SOT23-3); PROD_ID: TRANS-14388
R1 R13 R15 = SparkFun-Resistors:1KOHM: 1kΩ resistor A resistor is a passive two-terminal electrical component that implements electrical resistance as a circuit element. Resistors act to reduce current flow, and, at the same time, act to lower voltage levels within circuits. - Wikipedia; PROD_ID: RES-14342
R2 = SparkFun-Resistors:20KOHM: 20kΩ resistor A resistor is a passive two-terminal electrical component that implements electrical resistance as a circuit element. Resistors act to reduce current flow, and, at the same time, act to lower voltage levels within circuits. - Wikipedia; PROD_ID: RES-15131
R3 R4 = SparkFun-Resistors:5.1KOHM; PROD_ID: RES-14340
R5-R7 = SparkFun-Resistors:2.2KOHM: 2.2kΩ resistor A resistor is a passive two-terminal electrical component that implements electrical resistance as a circuit element. Resistors act to reduce current flow, and, at the same time, act to lower voltage levels within circuits. - Wikipedia; PROD_ID: RES-14341
R8 R14 R16 = SparkFun-Resistors:10KOHM: 10kΩ resistor A resistor is a passive two-terminal electrical component that implements electrical resistance as a circuit element. Resistors act to reduce current flow, and, at the same time, act to lower voltage levels within circuits. - Wikipedia; PROD_ID: RES-14241
R9 R11 R12 = SparkFun-Resistors:4.7KOHM: 4.7kΩ resistor A resistor is a passive two-terminal electrical component that implements electrical resistance as a circuit element. Resistors act to reduce current flow, and, at the same time, act to lower voltage levels within circuits. - Wikipedia; PROD_ID: RES-15343
R10 = SparkFun-Resistors:1MOHM: 1MΩ resistor A resistor is a passive two-terminal electrical component that implements electrical resistance as a circuit element. Resistors act to reduce current flow, and, at the same time, act to lower voltage levels within circuits. - Wikipedia; PROD_ID: RES-15185
RN1 RN3-RN5 = SparkFun_Thing_Plus_RA6M5:10KOHM-ARRAY(8)-2506_ARV-1/16W-5%; PROD_ID: RES-14952
S1 S2 = SparkFun-Switches:MOMENTARY-SWITCH-SPST: Momentary Switch (Pushbutton) - SPST Normally-open (NO) SPST momentary switches (buttons, pushbuttons). Variants PTH-12MM - 12mm square, through-hole Momentary Pushbutton Switch - 12mm Square <https://www.sparkfun.com/products/9190> (COM-09190) PTH-6.0MM, PTH-6.0MM-KIT - 6.0mm square, through-hole Mini Pushbutton Switch <https://www.sparkfun.com/products/97> (COM-00097) KIT package intended for soldering kit's - only one side of pads' copper is exposed. PTH-RIGHT-ANGLE-KIT - Right-angle, through-hole Right Angle Tactile Button <https://www.sparkfun.com/products/10791> - Used on SparkFun BigTime Watch Kit <https://www.sparkfun.com/products/11734> SMD-12MM - 12mm square, surface-mount Tactile Button - SMD (12mm) <https://www.sparkfun.com/products/12993> (COM-12993) Used on SparkFun PicoBoard <https://www.sparkfun.com/products/11888> SMD-4.5MM - 4.5mm Square Trackball Switch Used on SparkFun Blackberry Trackballer Breakout <https://www.sparkfun.com/products/13169> SMD-4.6MMX2.8MM - 4.60mm x 2.80mm, surface mount Used on SparkFun Pro Micro - RP2040 <https://www.sparkfun.com/products/17717> SMD-5.2MM, SMD-5.2-REDUNDANT - 5.2mm square, surface-mount Mini Pushbutton Switch - SMD <https://www.sparkfun.com/products/8720> (COM-08720) Used on Arduino Pro Mini <https://www.sparkfun.com/products/11114> REDUNDANT package connects both switch circuits together SMD-6.0X3.5MM - 6.0 x 3.5mm, surface mount Momentary Reset Switch SMD <https://www.sparkfun.com/products/8229> (COM-08229) SMD-6.2MM-TALL - 6.2mm square, surface mount Tactile Button - SMD (6mm) <https://www.sparkfun.com/products/12992> Used on SparkFun Digital Sandbox <https://www.sparkfun.com/products/12651> SMD-RIGHT-ANGLE - Right-angle, surface mount Used on SparkFun Block for Intel® Edison - Arduino <https://www.sparkfun.com/products/13036>; PROD_ID: SWCH-15606
SUPPLYTIE1-SUPPLYTIE3 = SparkFun_Thing_Plus_RA6M5:2PT_GND_TIE: Dual Ground Supply Power supply symbol for connecting two grounds. SparkFun Products: SparkFun AutoDriver - Stepper Motor Driver <https://www.sparkfun.com/products/11611>
TP1-TP10 = SparkFun-Connectors:TEST-POINT: SparkFun Test Points Bare copper test points for troubleshooting or In-Circuit-Testing. These are used by our Production team for verifying production board runs using pogo-pins on test beds. SparkFun Products: SparkFun LSM9DS1 Breakout <https://www.sparkfun.com/products/13284> SparkFun PSOC <https://www.sparkfun.com/products/13714> SparkFun Load Cell Amplifier <https://www.sparkfun.com/products/13879>
U1 = SparkFun_Thing_Plus_RA6M5:R7FA6M5-100LQFP; PROD_ID: IC-20781
U2 = SparkFun_Thing_Plus_RA6M5:DA14531MOD; PROD_ID: IC-20782
U3 = SparkFun-IC-Power:MCP73831: MCP73831T Li-Ion, Li-Pol Controller Miniature single cell, fully integrated Li-Ion, Li-polymer charge management controller Datasheet <http://ww1.microchip.com/downloads/en/DeviceDoc/20001984g.pdf> SparkFun Products: SparkFun ESP32 Thing <https://www.sparkfun.com/products/13907> SparkFun 9DoF Razor IMU M0 <https://www.sparkfun.com/products/14001>; PROD_ID: IC-09995
U4 U6 = SparkFun-IC-Power:V_REG_RT9080; PROD_ID: VREG-19034
U5 = SparkFun-IC-Memory:MX25L12833F_128MBIT_QSPI: Macronix MX25L12833FZNI-10G 128MBit QSPI MX25L12833F is 128Mb bits Serial NOR Flash memory.; PN: MX25L12833F-10G; PROD_ID: IC-21738
U7 = SparkFun-IC-Power:MAX17048: Micropower 1-Cell Li+ ModelGauge SparkFun Products Qduino Mini <https://www.sparkfun.com/products/13614> (DEV-13614); PROD_ID: IC-12551
U8 = SparkFun_Thing_Plus_RA6M5:IDEAL_DIODE_DUAL_LM66200; PROD_ID: IC-20783
Y1 = SparkFun_Thing_Plus_RA6M5:CRYSTAL-24.000MHZ-8PF-4-SMD; PN: RH100-24.000-8-1015-EXT-TR-NS1; PROD_ID: XTAL-20784
Y2 = SparkFun-Clocks:CRYSTAL-32.768KHZ: 32.768kHz Crystal Frequency: 32.768kHz Frequency Stability: ±20ppm Load Capacitance: 12.5pF (PTH-2X6 & SMD-3.2X1.5), 6pF (SMD-2X6) SparkFun Products: SparkFun BigTime Watch Kit <https://www.sparkfun.com/products/11734> SparkFun nRF52832 Breakout <https://www.sparkfun.com/products/13990> SparkFun Real Time Clock Module <https://www.sparkfun.com/products/12708>; PROD_ID: XTAL-13062

## Net classes
2 CLK signals: width 0.15 mm, drill 0.2 mm, clearance 0.15 mm to class 0, clearance 0.15 mm to class 1, clearance 0.15 mm
3 Analog Ground: width 0.2 mm, clearance 0.2 mm to class 1, clearance 0.3 mm to class 2
4 Power: width 0.2 mm, drill 0.3 mm, clearance 0.2 mm to class 0, clearance 0.1 mm to class 1, clearance 0.15 mm to class 2, clearance 0.2 mm to class 3, clearance 0.2 mm
5 USB diff: width 0.16 mm, drill 0.2 mm, clearance 0.3 mm to class 0, clearance 0.3 mm to class 1, clearance 0.3 mm to class 2, clearance 0.3 mm to class 3, clearance 0.2 mm to class 4, clearance 0.22 mm